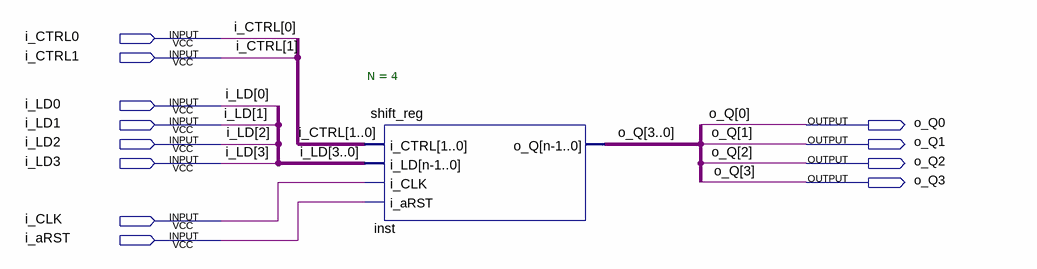
[diagram p0: schematic sheet]
// Quartus schematic UniversalShiftReg.bdf as structural Verilog: 1 symbols, 12 pins
module UniversalShiftReg (
  input  i_CTRL0,
  input  i_CTRL1,
  input  i_LD0,
  input  i_LD1,
  input  i_LD2,
  input  i_LD3,
  input  i_CLK,
  input  i_aRST,
  output o_Q0,
  output o_Q1,
  output o_Q2,
  output o_Q3
);

  shift_reg #(.N(4)) inst (
    .i_CTRL({i_CTRL1, i_CTRL0}), .i_LD({i_LD3, i_LD2, i_LD1, i_LD0}), .i_CLK(i_CLK), .i_aRST(i_aRST),
    .o_Q({o_Q3, o_Q2, o_Q1, o_Q0}));
endmodule
